# Altium schematic sheet РЕУН.468323.001_Connectors.SchDoc: Плата
size 840 x 594 mm; ApprovedBy: Шавликов; CheckedBy: Шавликов; DrawnBy: Подлесный; SheetNumber: 1; SheetTotal: 12; Вид изделия: Документация; Раздел: Документация; Код документа: Э3; Вид документа: Схема электрическая принципиальная; Класс документа: Конструкторский документ; Создавать изделие в PLM: Yes; DocumentCode: РЕУН.468323.001 Э3 2D; DocumentView: Схема электрическая принципиальная; DocumentClass: Конструкторский документ; ProductView: Документация; DocName: Плата; Title_2: управления; DocumentType: Схема электрическая принципиальная; Format: А1; ImagePath: РЕУН.468323.001 ТЭ
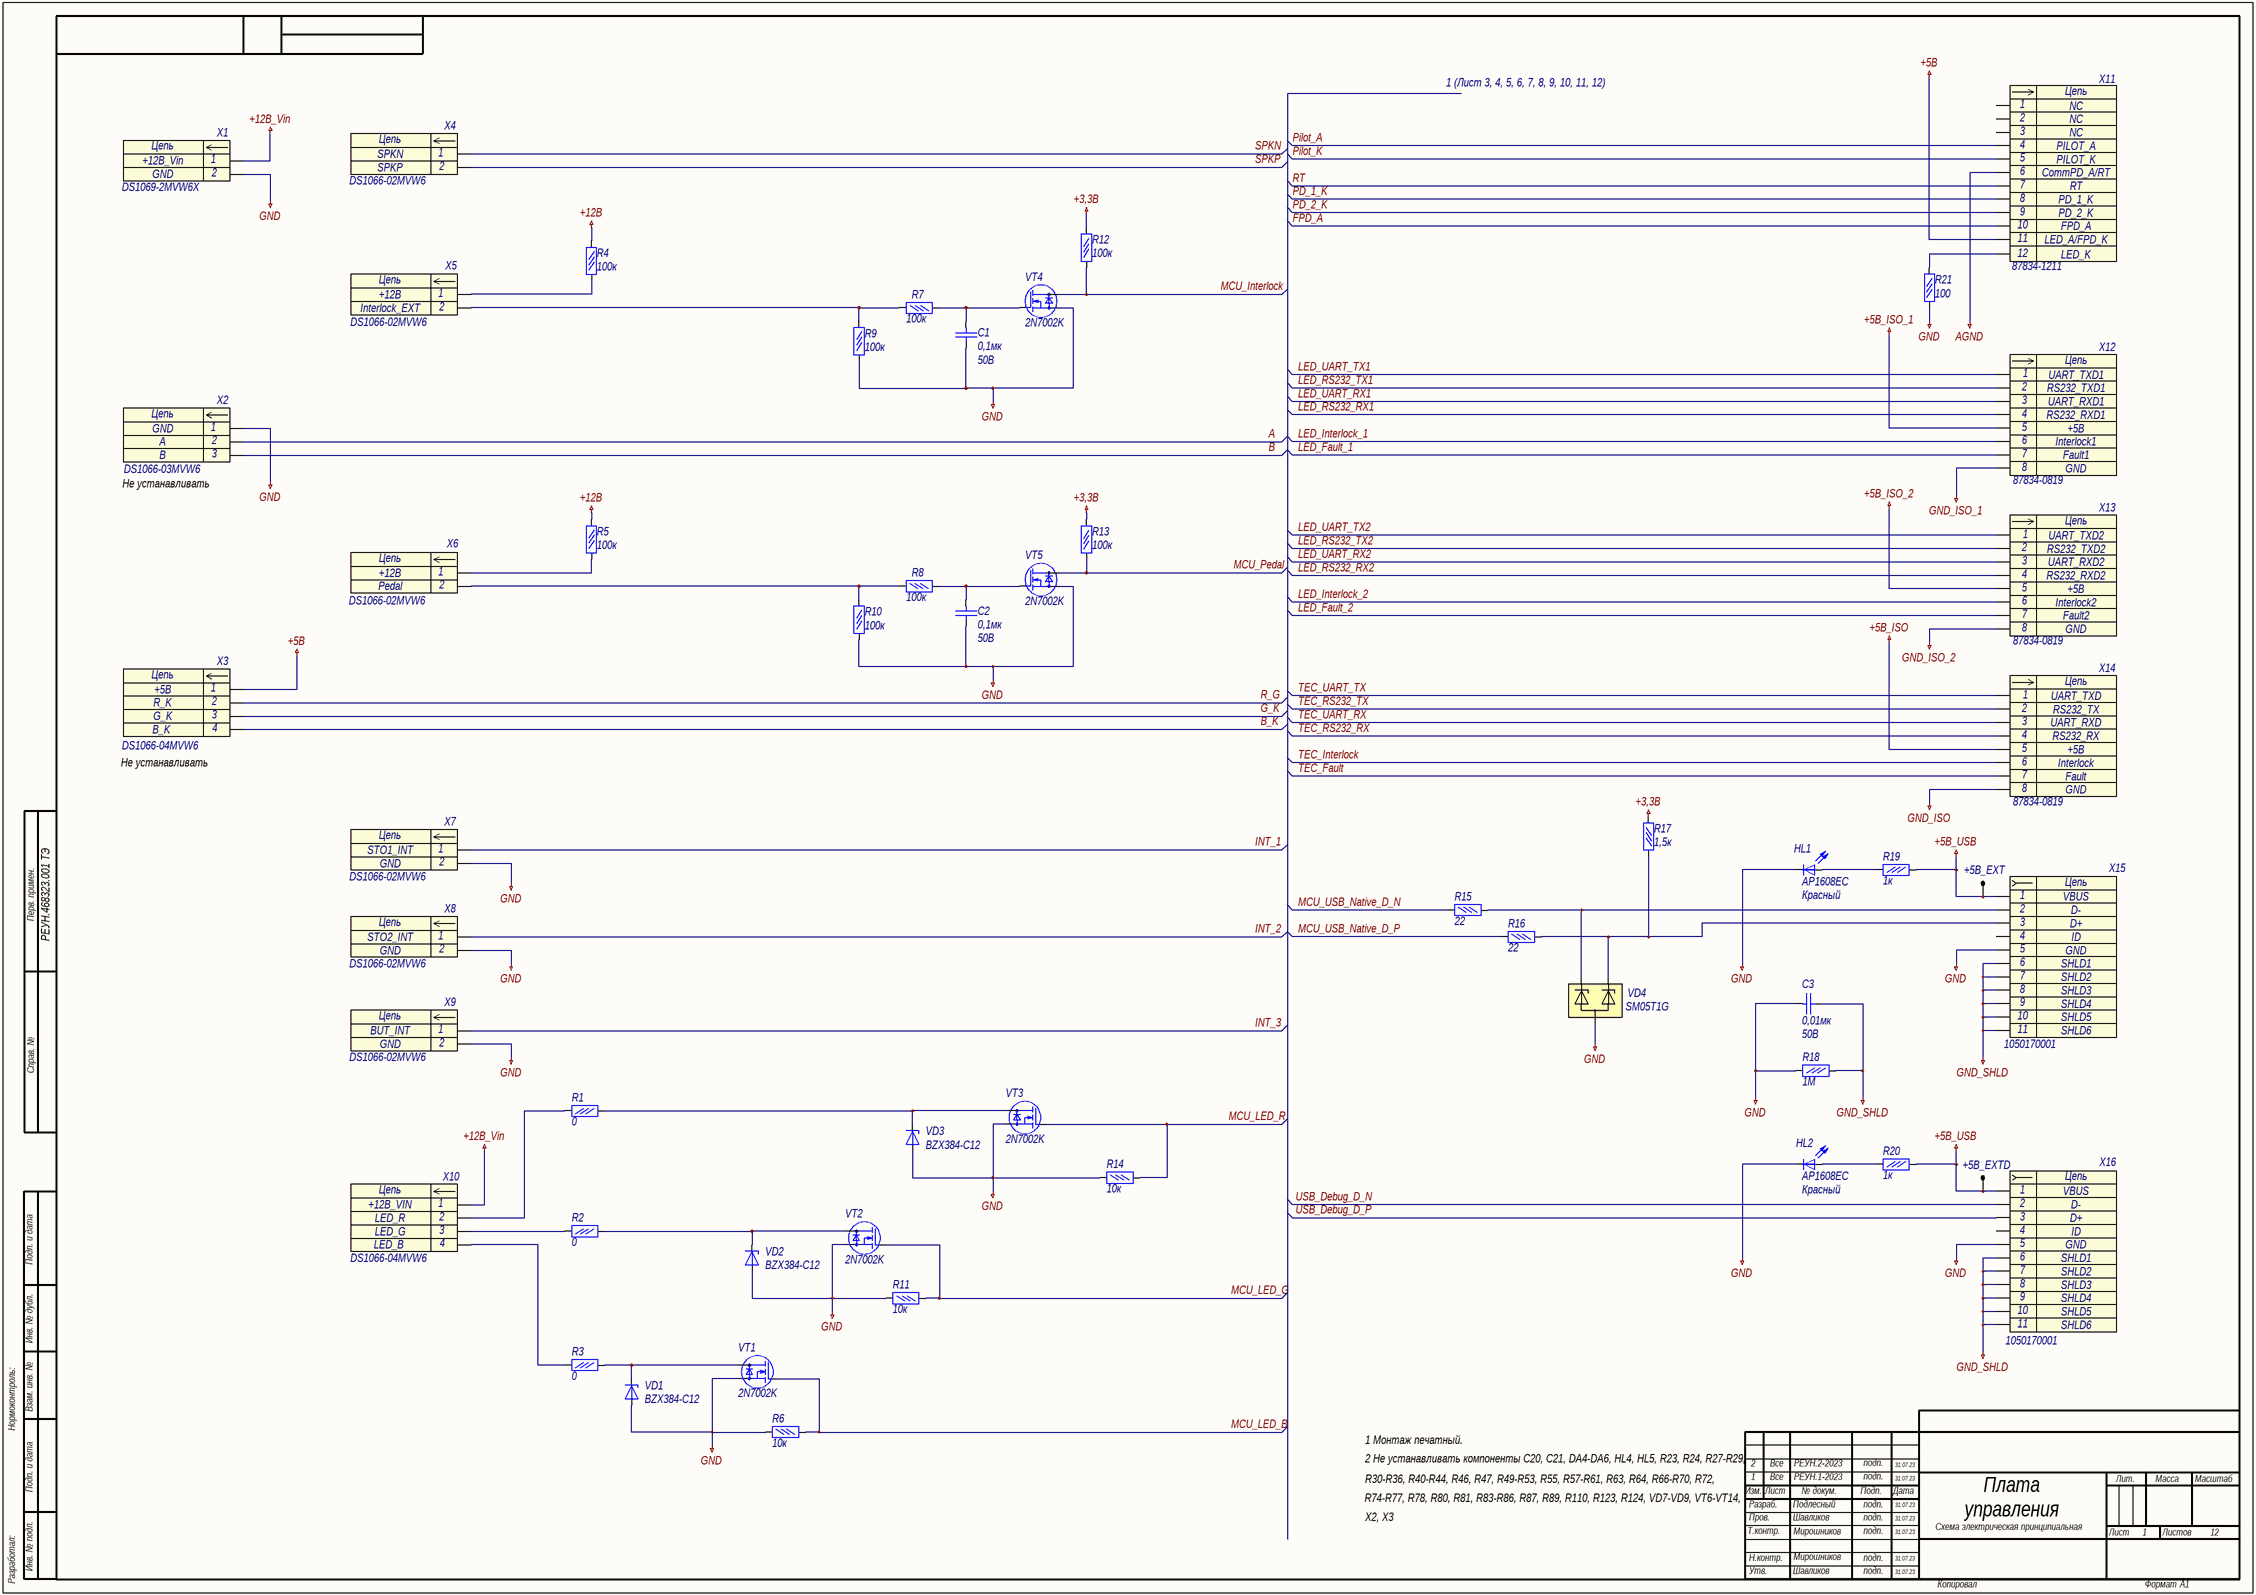
[diagram p0: РЕУН.468323.001_Connectors.SchDoc]

## Parts
+5В_EXT  "1"  [0.5 x 1_round]  (value not drawn)
+5В_EXTD  "1"  [0.5 x 1_round]  (value not drawn)
C1  Voltage: 50В  [C0805_AA]  (hidden comment: 0,1мк)
C2  Voltage: 50В  [C0805_AA]  (hidden comment: 0,1мк)
C3  Voltage: 50В  [C0805_AA]  (hidden comment: 0,01мк)
HL1  Color: Красный  (hidden comment: AP1608EC)
HL2  Color: Красный  (hidden comment: AP1608EC)
R1  0  [R1206]
R2  0  [R1206]
R3  0  [R1206]
R4  100к  [R1206]
R5  100к  [R1206]
R6  10к  [R1206]
R7  100к  [R1206]
R8  100к  [R1206]
R9  100к  [R1206]
R10  100к  [R1206]
R11  10к  [R1206]
R12  100к  [R1206]
R13  100к  [R1206]
R14  10к  [R1206]
R15  22  [R1206]
R16  22  [R1206]
R17  1,5к  [R1206]
R18  1M  [R1206]
R19  1к  [R1206]
R20  1к  [R1206]
R21  100  [R1206]
VD1  BZX384-C12  [SOT23-2_A]
VD2  BZX384-C12  [SOT23-2_A]
VD3  BZX384-C12  [SOT23-2_A]
VD4  SM05T1G
VT1  2N7002K  [SOT23-3]
VT2  2N7002K  [SOT23-3]
VT3  2N7002K  [SOT23-3]
VT4  2N7002K  [SOT23-3]
VT5  2N7002K  [SOT23-3]
X1  DS1069-2MVW6X
X2  DS1066-03MVW6
X3  DS1066-04MVW6
X4  DS1066-02MVW6
X5  DS1066-02MVW6
X6  DS1066-02MVW6
X7  DS1066-02MVW6
X8  DS1066-02MVW6
X9  DS1066-02MVW6
X10  DS1066-04MVW6
X11  87834-1211
X12  87834-0819
X13  87834-0819
X14  87834-0819
X15  1050170001
X16  1050170001

## Nets
+3,3В: R12.1 R13.1 R17.2
+5В: X3.1 X11.10
+5В_ISO: X14.5
+5В_ISO_1: X12.5
+5В_ISO_2: X13.5
+5В_USB: +5В_EXT.1 +5В_EXTD.1 R19.2 R20.2 X15.1 X16.1
+12В: R4.2 R5.2
+12В_Vin: X1.1 X10.1
AGND: X11.6
GND: C1.1 C2.1 C3.2 HL1.2(K) HL2.2(K) R6.1 R9.1 R10.1 R11.2 R14.1 R18.1 R21.2 VD1.2(A) VD2.2(A) VD3.2(A) VD4.3 VT1.2(S) VT2.2(S) VT3.2(S) VT4.2(S) VT5.2(S) X1.2 X2.1 X7.2 X8.2 X9.2 X15.5 X16.5
GND_ISO: X14.8
GND_ISO_1: X12.8
GND_ISO_2: X13.8
GND_SHLD: C3.1 R18.2 X15.6 X15.7 X15.8 X15.9 X15.10 X16.6 X16.7 X16.8 X16.9 X16.10
A: X2.2
B: X2.2
B_K: X3.2
FPD_A: X11.10
G_K: X3.2
INT_1: X7.1
INT_2: X8.1
INT_3: X9.1
LED_Fault_1: X12.7
LED_Fault_2: X13.7
LED_Interlock_1: X12.6
LED_Interlock_2: X13.6
LED_RS232_RX1: X12.4
LED_RS232_RX2: X13.4
LED_RS232_TX1: X12.2
LED_RS232_TX2: X13.2
LED_UART_RX1: X12.3
LED_UART_RX2: X13.3
LED_UART_TX1: X12.1
LED_UART_TX2: X13.1
MCU_Interlock: R12.2 VT4.3(D)
MCU_LED_B: R6.2 VT1.1(G)
MCU_LED_G: R11.1 VT2.1(G)
MCU_LED_R: R14.2 VT3.1(G)
MCU_Pedal: R13.2 VT5.3(D)
MCU_USB_Native_D_N: R15.1
MCU_USB_Native_D_P: R16.1
PD_1_K: X11.8
PD_2_K: X11.9
Pilot_A: X11.4
Pilot_K: X11.5
R_G: X3.2
RT: X11.7
SPKN: X4.1
SPKP: X4.2
TEC_Fault: X14.7
TEC_Interlock: X14.6
TEC_RS232_RX: X14.4
TEC_RS232_TX: X14.2
TEC_UART_RX: X14.3
TEC_UART_TX: X14.1
USB_Debug_D_N: X16.2
USB_Debug_D_P: X16.3
NetC1_2: C1.2 R7.1 VT4.1(G)
NetC2_2: C2.2 R8.2 VT5.1(G)
NetHL1_1: HL1.1(A) R19.1
NetHL2_1: HL2.1(A) R20.1
NetR1_1: R1.1 VD3.1(K) VT3.3(D)
NetR1_2: R1.2 X10.2
NetR2_1: R2.1 VD2.1(K) VT2.3(D)
NetR2_2: R2.2 X10.2
NetR3_1: R3.1 VD1.1(K) VT1.3(D)
NetR3_2: R3.2 X10.2
NetR4_1: R4.1 X5.1
NetR5_1: R5.1 X6.1
NetR7_2: R7.2 R9.2 X5.2
NetR8_1: R8.1 R10.2 X6.2
NetR15_2: R15.2 VD4.1 X15.2
NetR16_2: R16.2 R17.1 VD4.2 X15.3
NetR21_1: R21.1 X11.10

Not connected (* = marked no-connect by the designer): X11 1 2 3; X15 4; X16 4

## Notes on the sheet
- 1 (Лист 3, 4, 5, 6, 7, 8, 9, 10, 11, 12)
- (near X2) Не устанавливать
- Не устанавливать
- 1 Монтаж печатный.
- 2 Не устанавливать компоненты C20, C21, DA4-DA6, HL4, HL5, R23, R24, R27-R29,
- 2
- Все
- РЕУН.2-2023
- подп.
- 31.07.23
- R74-R77, R78, R80, R81, R83-R86, R87, R89, R110, R123, R124, VD7-VD9, VT6-VT14,
- R30-R36, R40-R44, R46, R47, R49-R53, R55, R57-R61, R63, R64, R66-R70, R72,
- 1
- РЕУН.1-2023
- X2, X3
- Мирошников
- Перв. примен.
- Справ. №
- Подп. и дата
- Инв. № дубл.
- Нормоконтроль:
- Взам. инв. №
- Изм.
- Лист
- № докум.
- Подп.
- Дата
- Лит.
- Масса
- Масштаб
- Т.контр.
- Пров.
- Разраб.
- Листов
- Разработал:
- Инв. № подл.
- Н.контр.
- Утв.
- Копировал
- Формат
- (in symbol x8-m) Цепь
- (in symbol x8-m_1) Цепь
- (in symbol x8-m_1_1) Цепь
- (in symbol x8-m_1_1_1) Цепь
- (in symbol x10-m_1) Цепь; 11
- (in symbol x10-m_1_1) Цепь; 11; 12

## Library data of the parts
+5В_EXT +5В_EXTD = TestPoint: Test point; Comment_1: "1"
C1-C3 = Конденсатор кер.
  C1 C2: Value: 0,1мк
  C3: Value: 0,01мк
HL1 HL2 = led: Светодиод; Name: AP1608EC
R1-R21 = Резистор  0,05Вт: Резистор 0,05Вт; Power rating: 0,05Вт
  R1-R3: Value: 0
  R4 R5 R7-R10 R12 R13: Value: 100к
  R6 R11 R14: Value: 10к
  R15 R16: Value: 22
  R17: Value: 1,5к
  R18: Value: 1M
  R19 R20: Value: 1к
  R21: Value: 100
VD1-VD3 = DiodeZener: Стабилитрон; Name: BZX384-C12
VD4 = ZenerArray2: Сборка TVS-диодов
VT1-VT5 = mosfet-n: Name: 2N7002K
X1 = x8-m_1: Разъем - 8 конт. вилка; Contact_1: +12В_Vin; Contact_2: GND; Contact_3: Contact_3; Contact_4: Contact_4; Contact_5: Contact_5; Contact_6: Contact_6; Contact_7: Contact_7; Contact_8: Contact_8; Name: DS1069-2MVW6X
X2 = x8-m_1_1: Разъем - 8 конт. вилка; Contact_1: GND; Contact_2: A; Contact_3: B; Contact_4: Contact_4; Contact_5: Contact_5; Contact_6: Contact_6; Contact_7: Contact_7; Contact_8: Contact_8; Name: DS1066-03MVW6
X3 = x8-m_1_1_1: Разъем - 8 конт. вилка; Contact_1: +5В; Contact_2: R_K; Contact_3: G_K; Contact_4: B_K; Contact_5: Contact_5; Contact_6: Contact_6; Contact_7: Contact_7; Contact_8: Contact_8; Name: DS1066-04MVW6
X4 = x8-m_1: Разъем - 8 конт. вилка; Contact_1: SPKN; Contact_2: SPKP; Contact_3: Contact_3; Contact_4: Contact_4; Contact_5: Contact_5; Contact_6: Contact_6; Contact_7: Contact_7; Contact_8: Contact_8; Name: DS1066-02MVW6
X5 = x8-m_1: Разъем - 8 конт. вилка; Contact_1: +12В; Contact_2: Interlock_EXT; Contact_3: Contact_3; Contact_4: Contact_4; Contact_5: Contact_5; Contact_6: Contact_6; Contact_7: Contact_7; Contact_8: Contact_8; Name: DS1066-02MVW6
X6 = x8-m_1: Разъем - 8 конт. вилка; Contact_1: +12В; Contact_2: Pedal; Contact_3: Contact_3; Contact_4: Contact_4; Contact_5: Contact_5; Contact_6: Contact_6; Contact_7: Contact_7; Contact_8: Contact_8; Name: DS1066-02MVW6
X7 = x8-m_1: Разъем - 8 конт. вилка; Contact_1: STO1_INT; Contact_2: GND; Contact_3: Contact_3; Contact_4: Contact_4; Contact_5: Contact_5; Contact_6: Contact_6; Contact_7: Contact_7; Contact_8: Contact_8; Name: DS1066-02MVW6
X8 = x8-m_1: Разъем - 8 конт. вилка; Contact_1: STO2_INT; Contact_2: GND; Contact_3: Contact_3; Contact_4: Contact_4; Contact_5: Contact_5; Contact_6: Contact_6; Contact_7: Contact_7; Contact_8: Contact_8; Name: DS1066-02MVW6
X9 = x8-m_1: Разъем - 8 конт. вилка; Contact_1: BUT_INT; Contact_2: GND; Contact_3: Contact_3; Contact_4: Contact_4; Contact_5: Contact_5; Contact_6: Contact_6; Contact_7: Contact_7; Contact_8: Contact_8; Name: DS1066-02MVW6
X10 = x8-m_1_1_1: Разъем - 8 конт. вилка; Contact_1: +12В_VIN; Contact_2: LED_R; Contact_3: LED_G; Contact_4: LED_B; Contact_5: Contact_5; Contact_6: Contact_6; Contact_7: Contact_7; Contact_8: Contact_8; Name: DS1066-04MVW6
X11 = x10-m_1_1: Разъем - 10 конт. вилка; Contact_1: NC; Contact_4: PILOT_A; Contact_5: PILOT_K; Contact_6: CommPD_A/RT; Contact_7: RT; Contact_8: PD_1_K; Contact_9: PD_2_K; Contact_10: FPD_A; Contact_11: LED_A/FPD_K; Contact_12: LED_K; Contact_2: NC; Contact_3: NC; Name: 87834-1211
X12 = x8-m: Разъем - 8 конт. вилка; Contact_1: UART_TXD1; Contact_2: RS232_TXD1; Contact_3: UART_RXD1; Contact_4: RS232_RXD1; Contact_5: +5В; Contact_6: Interlock1; Contact_7: Fault1; Contact_8: GND; Name: 87834-0819
X13 = x8-m: Разъем - 8 конт. вилка; Contact_1: UART_TXD2; Contact_2: RS232_TXD2; Contact_3: UART_RXD2; Contact_4: RS232_RXD2; Contact_5: +5В; Contact_6: Interlock2; Contact_7: Fault2; Contact_8: GND; Name: 87834-0819
X14 = x8-m: Разъем - 8 конт. вилка; Contact_1: UART_TXD; Contact_2: RS232_TX; Contact_3: UART_RXD; Contact_4: RS232_RX; Contact_5: +5В; Contact_6: Interlock; Contact_7: Fault; Contact_8: GND; Name: 87834-0819
X15 X16 = x10-m_1: Разъем - 10 конт. вилка; Contact_1: VBUS; Contact_2: D-; Contact_3: D+; Contact_4: ID; Contact_5: GND; Contact_6: SHLD1; Contact_7: SHLD2; Contact_8: SHLD3; Contact_9: SHLD4; Contact_10: SHLD5; Contact_11: SHLD6; Name: 1050170001